# EAGLE design esp32_shield (EAGLE 7.2.0)
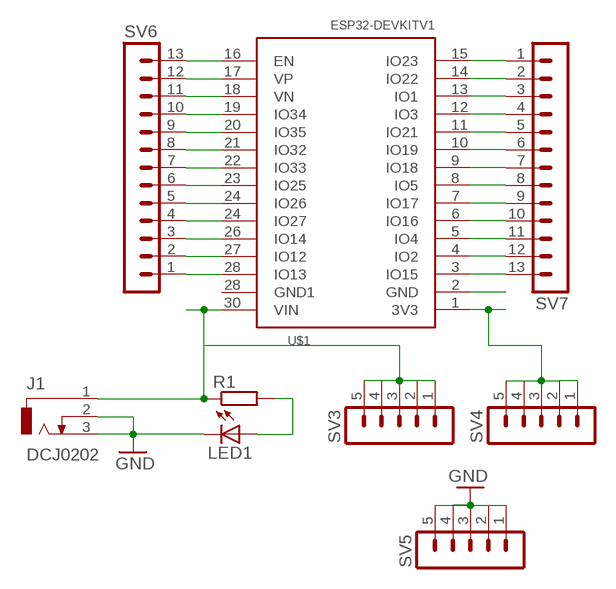
[diagram p0: schematic, sheet 1]

## Parts
J1  DCJ0202  [DCJ0202]
LED1  LED5MM  [LED5MM]
R1  R-EU_0204/7  [0204/7]
SV3  MA05-1  [MA05-1]
SV4  MA05-1  [MA05-1]
SV5  MA05-1  [MA05-1]
SV6  MA13-1  [MA13-1]
SV7  MA13-1  [MA13-1]
U$1  ESP32DEVKITV1  [ESP32-DEVKITV1]

## Nets
GND: J1.2 J1.3 LED1.K(C) SV5.1 SV5.2 SV5.3 SV5.4 SV5.5
N$1: SV7.1 U$1.15(IO23)
N$2: SV7.2 U$1.14(IO22)
N$3: SV7.3 U$1.13(IO1)
N$4: SV7.4 U$1.12(IO3)
N$5: SV7.5 U$1.11(IO21)
N$6: SV7.6 U$1.10(IO19)
N$7: SV7.7 U$1.9(IO18)
N$8: SV7.8 U$1.8(IO5)
N$9: SV7.9 U$1.7(IO17)
N$10: SV7.10 U$1.6(IO16)
N$11: SV7.11 U$1.5(IO4)
N$12: SV7.12 U$1.4(IO2)
N$13: SV7.13 U$1.3(IO15)
N$14: U$1.2(GND)
N$15: SV4.1 SV4.2 SV4.3 SV4.4 SV4.5 U$1.1(3V3)
N$16: J1.1 R1.1 SV3.1 SV3.2 SV3.3 SV3.4 SV3.5 U$1.30(VIN)
N$19: SV6.2 U$1.27(IO12)
N$20: SV6.3 U$1.26(IO14)
N$23: SV6.6 U$1.23(IO25)
N$24: SV6.7 U$1.22(IO33)
N$25: SV6.8 U$1.21(IO32)
N$26: SV6.9 U$1.20(IO35)
N$27: SV6.10 U$1.19(IO34)
N$28: SV6.11 U$1.18(VN)
N$29: SV6.12 U$1.17(VP)
N$30: SV6.13 U$1.16(EN)
N$31: SV6.1 U$1.28(IO13)
N$32: LED1.A R1.2
N$33: SV6.4 U$1.24(IO27)
N$34: SV6.5 U$1.24(IO26)
Unconnected: U$1.28(GND1)

## Library data of the parts
J1 = con-jack:DCJ0202: DC POWER JACK Source: DCJ0202.pdf; OC_FARNELL: unknown; OC_NEWARK: unknown
LED1 = led:LED: LED OSRAM: - CHIPLED LG R971, LG N971, LY N971, LG Q971, LY Q971, LO R971, LY R971 LH N974, LH R974 LS Q976, LO Q976, LY Q976 LO Q996 - Hyper CHIPLED LW Q18S LB Q993, LB Q99A, LB R99A - SideLED LS A670, LO A670, LY A670, LG A670, LP A670 LB A673, LV A673, LT A673, LW A673 LH A674 LY A675 LS A676, LA A676, LO A676, LY A676, LW A676 LS A679, LY A679, LG A679 - Hyper Micro SIDELED® LS Y876, LA Y876, LO Y876, LY Y876 LT Y87S - SmartLED LW L88C, LW L88S LB L89C, LB L89S, LG L890 LS L89K, LO L89K, LY L89K LS L896, LA L896, LO L896, LY L896 - TOPLED LS T670, LO T670, LY T670, LG T670, LP T670 LSG T670, LSP T670, LSY T670, LOP T670, LYG T670 LG T671, LOG T671, LSG T671 LB T673, LV T673, LT T673, LW T673 LH T674 LS T676, LA T676, LO T676, LY T676, LB T676, LH T676, LSB T676, LW T676 LB T67C, LV T67C, LT T67C, LS T67K, LO T67K, LY T67K, LW E67C LS E67B, LA E67B, LO E67B, LY E67B, LB E67C, LV E67C, LT E67C LW T67C LS T679, LY T679, LG T679 LS T770, LO T770, LY T770, LG T770, LP T770 LB T773, LV T773, LT T773, LW T773 LH T774 LS E675, LA E675, LY E675, LS T675 LS T776, LA T776, LO T776, LY T776, LB T776 LHGB T686 LT T68C, LB T68C - Hyper Mini TOPLED® LB M676 - Mini TOPLED Santana® LG M470 LS M47K, LO M47K, LY M47K Source: http://www.osram.convergy.de LUXEON: - LUMILED® LXK2-PW12-R00, LXK2-PW12-S00, LXK2-PW14-U00, LXK2-PW14-V00 LXK2-PM12-R00, LXK2-PM12-S00, LXK2-PM14-U00 LXK2-PE12-Q00, LXK2-PE12-R00, LXK2-PE12-S00, LXK2-PE14-T00, LXK2-PE14-U00 LXK2-PB12-K00, LXK2-PB12-L00, LXK2-PB12-M00, LXK2-PB14-N00, LXK2-PB14-P00, LXK2-PB14-Q00 LXK2-PR12-L00, LXK2-PR12-M00, LXK2-PR14-Q00, LXK2-PR14-R00 LXK2-PD12-Q00, LXK2-PD12-R00, LXK2-PD12-S00 LXK2-PH12-R00, LXK2-PH12-S00 LXK2-PL12-P00, LXK2-PL12-Q00, LXK2-PL12-R00 Source: www.luxeon.com KINGBRIGHT: KA-3528ASYC Source: www.kingbright.com
R1 = resistor:R-EU_: RESISTOR, European symbol
SV3-SV5 = con-lstb:MA05-1: PIN HEADER; OC_FARNELL: unknown; OC_NEWARK: unknown
SV6 SV7 = con-lstb:MA13-1: PIN HEADER; OC_FARNELL: unknown; OC_NEWARK: unknown
U$1 = ESP32-DEVKITV1:ESP32DEVKITV1

## Board
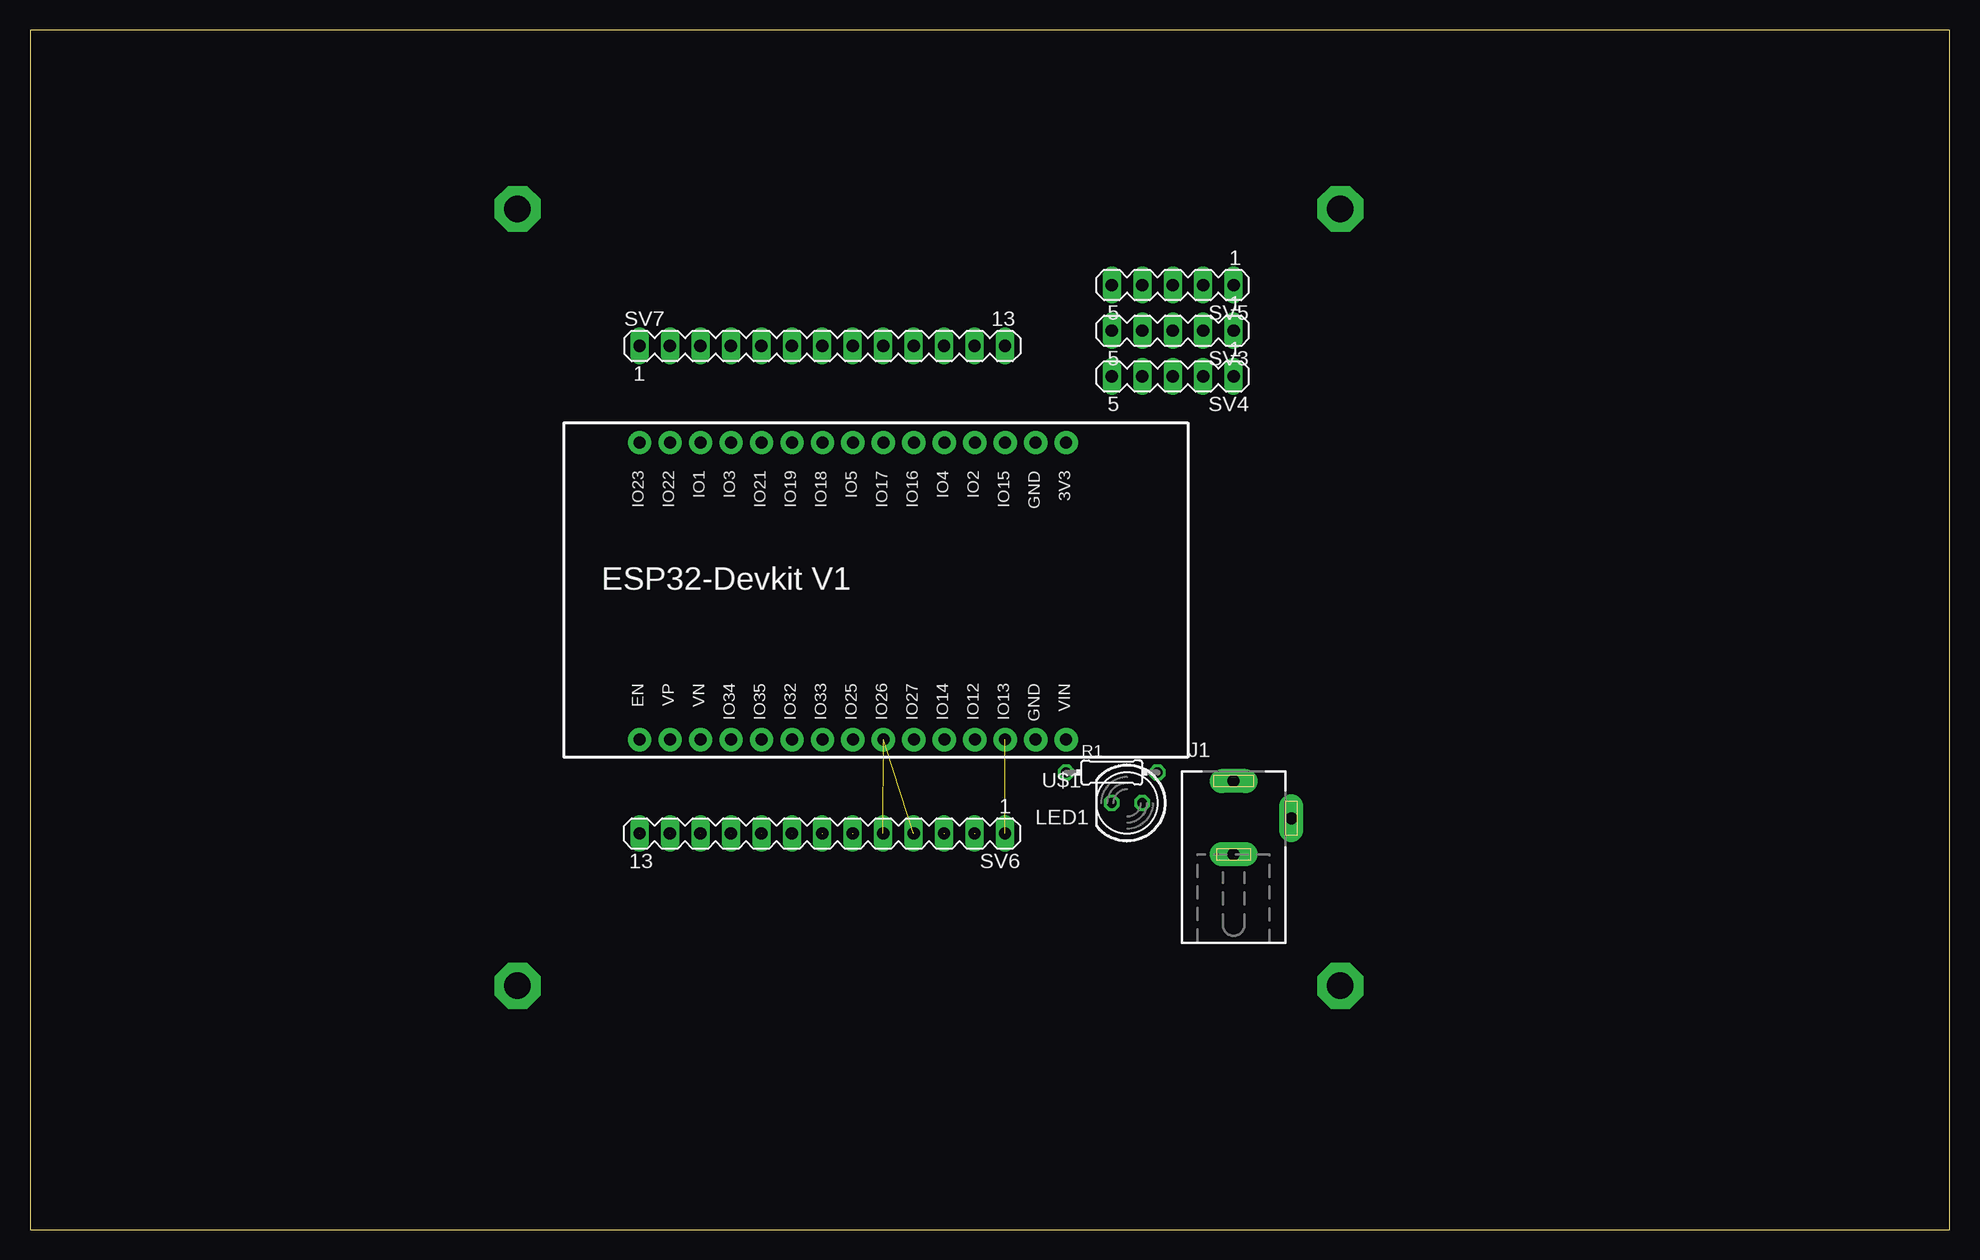
[diagram p1: board, top side]
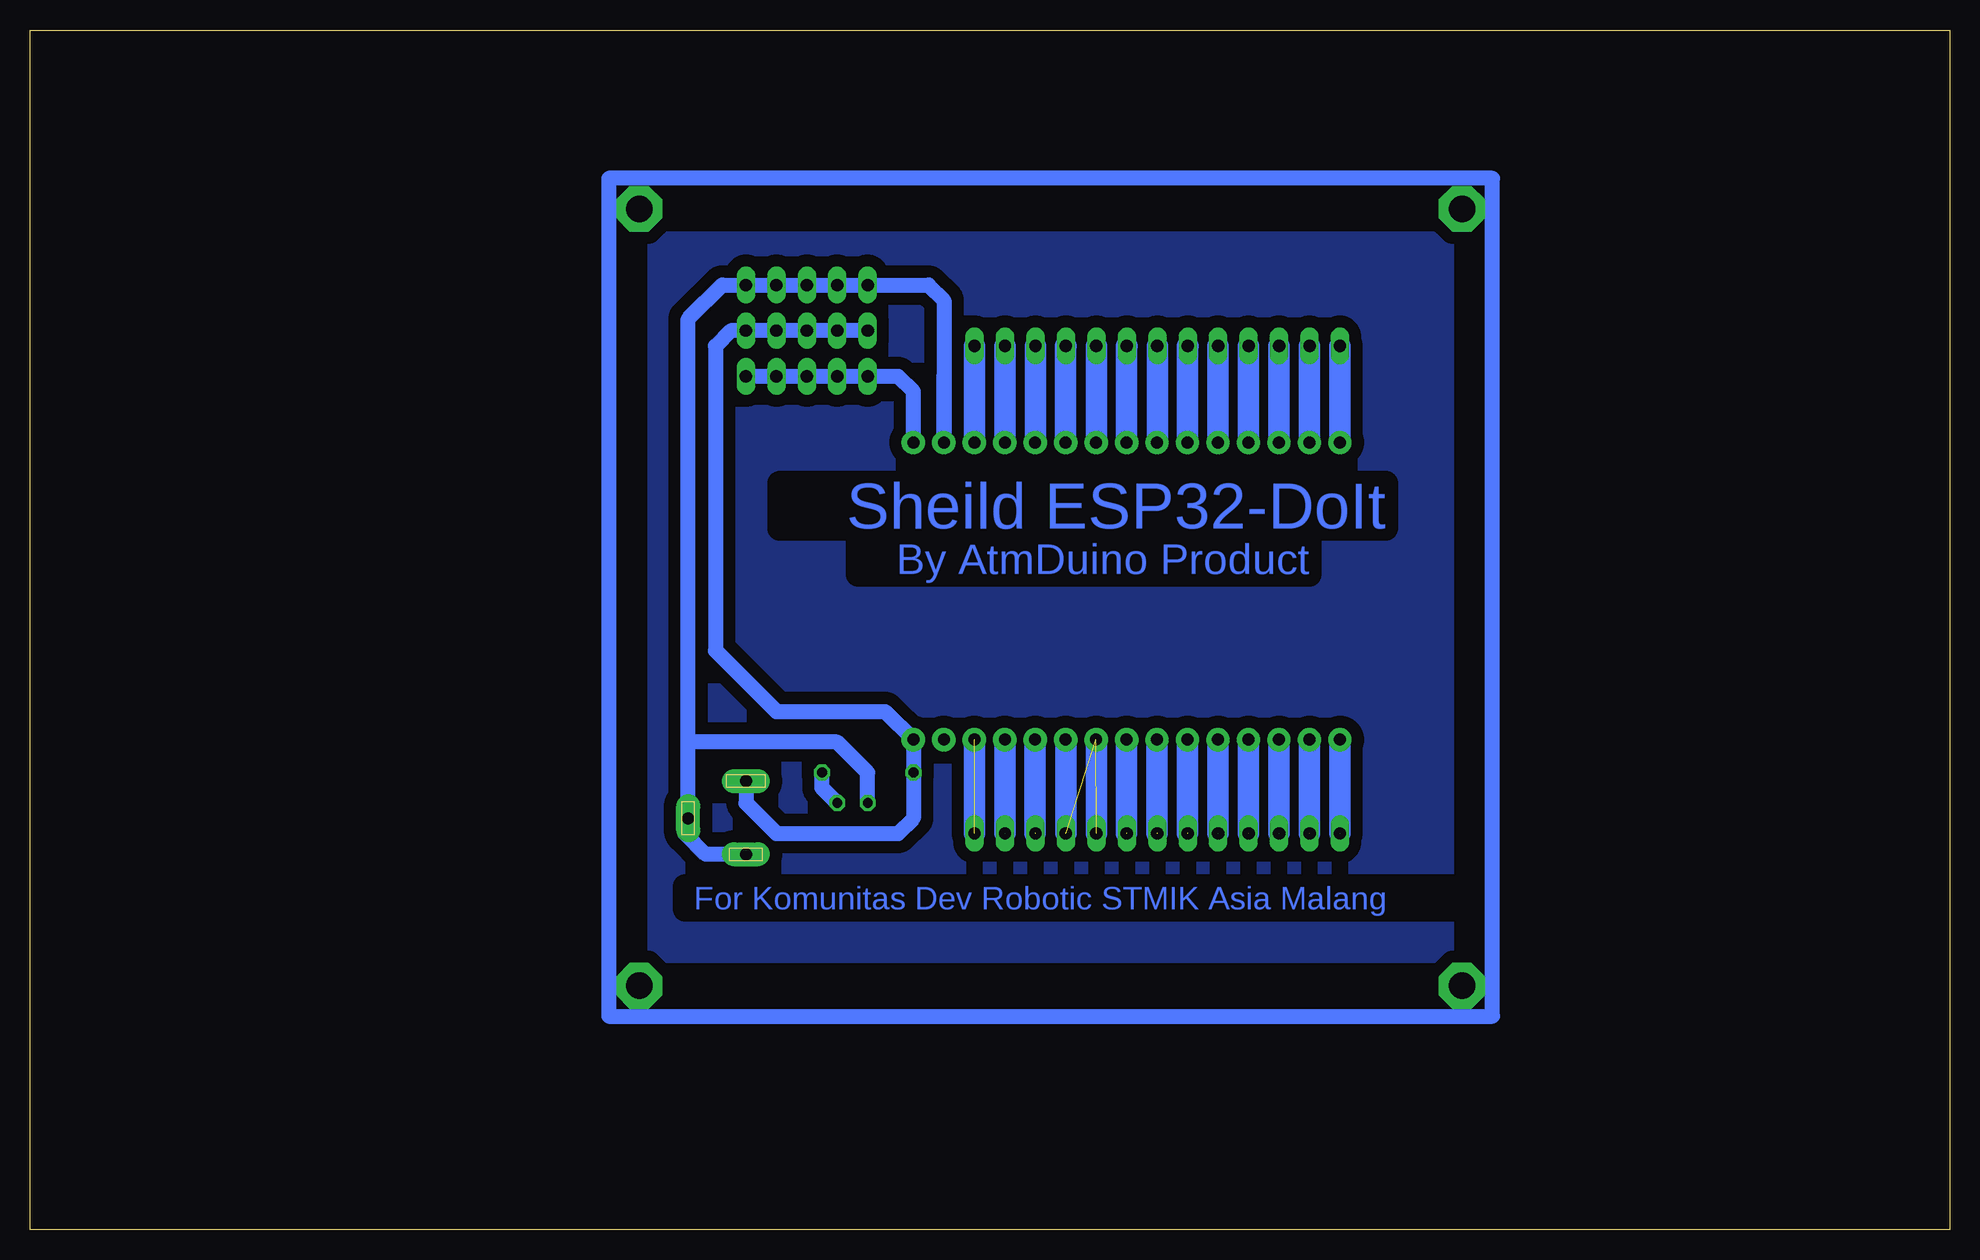
[diagram p2: board, bottom side, seen from below]

Size 160 x 100 mm. Coordinates in mm from the lower left corner, seen from the top.
Outline: 0,0 160,0 160,100 0,100 0,0
Copper layers (1*16): Top 0.035mm / dielectric 1.5mm / Bottom 0.035mm
Design rules "default": minimum track width 10mil, minimum drill 24mil, track to track 8mil, track to pad 8mil, pad to pad 8mil, via to via 8mil, smd to smd 8mil, copper to edge 40mil, drill to drill 8mil, minimum pad ring 10mil, minimum via ring 8mil, stop-mask expansion 4mil, vias tented up to drill 0mil, thermal gap 10mil

### Footprints (pad centres in the part's own frame; a part is rotated, then mirrored left to right if it is on the bottom)
DCJ0202 = drill 1 pad 2 long: 1 0,3.1; 2 4.8,0; 3 0,-3
LED5MM = drill 0.813 octagon: A -1.27,0; K 1.27,0
0204/7 = drill 0.813 octagon: 1 -3.81,0; 2 3.81,0
MA05-1 = drill 1.016 long: 1 -5.08,0; 2 -2.54,0; 3 0,0; 4 2.54,0; 5 5.08,0
MA13-1 = drill 1.016 long: 1 -15.24,0; 2 -12.7,0; 3 -10.16,0; 4 -7.62,0; 5 -5.08,0; 6 -2.54,0; 7 0,0; 8 2.54,0; 9 5.08,0; 10 7.62,0; 11 10.16,0; 12 12.7,0; 13 15.24,0
ESP32-DEVKITV1 = drill 1 pad 1.93: 1 -22.87,-13.54; 2 -20.33,-13.54; 3 -17.79,-13.54; 4 -15.25,-13.54; 5 -12.71,-13.54; 6 -10.17,-13.54; 7 -7.63,-13.54; 8 -5.09,-13.54; 9 -2.55,-13.54; 10 -0.01,-13.54; 11 2.53,-13.54; 12 5.07,-13.54; 13 7.61,-13.54; 14 10.15,-13.54; 15 12.69,-13.54; 16 12.69,11.23; 17 10.15,11.23; 18 7.61,11.23; 19 5.07,11.23; 20 2.53,11.23; 21 -0.01,11.23; 22 -2.55,11.23; 23 -5.09,11.23; 24 -7.63,11.23; 25 -10.17,11.23; 26 -12.71,11.23; 27 -15.25,11.23; 28 -17.79,11.23; 29 -20.33,11.23; 30 -22.87,11.23

### Placement (x,y rotation side)
J1  100.33,34.29 0 top
LED1  91.44,35.56 180 top
R1  90.17,38.1 0 top
SV3  95.25,74.93 180 top
SV4  95.25,71.12 180 top
SV5  95.25,78.74 180 top
SV6  66.04,33.02 180 top
SV7  66.04,73.66 0 top
U$1  63.5,52.07 180 top

### Tracks (layer width: path | path; a pad name or v marks a point on that pad's centre or on a via)
GND
  Bottom 1.27: LED1.K 90.17,38.1 92.71,40.64 105.13,40.64 | J1.3 103.68,31.29 105.41,33.02 105.41,34.01 J1.2 105.13,40.64 | 105.13,40.64 105.13,75.92 102.31,78.74 SV5.1 SV5.2 SV5.3 SV5.4 SV5.5 85.09,78.74 83.82,77.47 83.82,66.04
N$1
  Bottom 1.778: U$1.15 SV7.1
N$2
  Bottom 1.778: U$1.14 SV7.2
N$3
  Bottom 1.778: U$1.13 SV7.3
N$4
  Bottom 1.778: SV7.4 U$1.12
N$5
  Bottom 1.778: SV7.5 U$1.11
N$6
  Bottom 1.778: U$1.10 SV7.6
N$7
  Bottom 1.778: SV7.7 U$1.9
N$8
  Bottom 1.778: U$1.8 SV7.8
N$9
  Bottom 1.778: SV7.9 U$1.7
N$10
  Bottom 1.778: U$1.6 SV7.10
N$11
  Bottom 1.778: SV7.11 U$1.5
N$12
  Bottom 1.778: U$1.4 SV7.12
N$13
  Bottom 1.778: SV7.13 U$1.3
N$14
  Bottom 1.27: U$1.2 83.83,71.11
N$15
  Bottom 1.27: SV4.1 SV4.2 SV4.3 SV4.4 SV4.5 87.63,71.12 86.37,69.86 U$1.1
N$16
  Bottom 1.27: SV3.1 SV3.2 SV3.3 SV3.4 SV3.5 101.6,74.93 102.87,73.66 102.87,48.26 97.79,43.18 88.71,43.18 U$1.30 R1.1 86.36,34.29 87.63,33.02 97.79,33.02 100.33,35.56 J1.1
N$17
  Bottom 1.778: 81.28,33.02 81.28,40.64
N$19  (1 unrouted)
  Bottom 1.778: U$1.27 SV6.2
N$20  (1 unrouted)
  Bottom 1.778: U$1.26 SV6.3
N$21
  Bottom 1.778: 71.12,33.02 71.12,40.64
N$22
  Bottom 1.778: 73.66,33.02 73.66,40.64
N$23  (1 unrouted)
  Bottom 1.778: U$1.23 SV6.6
N$24  (1 unrouted)
  Bottom 1.778: U$1.22 SV6.7
N$25  (1 unrouted)
  Bottom 1.778: U$1.21 SV6.8
N$26  (1 unrouted)
  Bottom 1.778: U$1.20 SV6.9
N$27  (1 unrouted)
  Bottom 1.778: U$1.19 SV6.10
N$28  (1 unrouted)
  Bottom 1.778: U$1.18 SV6.11
N$29  (1 unrouted)
  Bottom 1.778: U$1.17 SV6.12
N$30  (1 unrouted)
  Bottom 1.778: U$1.16 SV6.13
N$31  (1 unrouted)
N$32
  Bottom 1.27: LED1.A 93.98,36.83 R1.2
N$33  (1 unrouted)
N$34  (1 unrouted)
N$35
  pour Bottom (isolate 1.016): 41.91,22.86 41.91,82.55 107.95,82.55 107.95,22.86
N$36
  Bottom 1.27: 38.1,17.78 38.1,87.63 111.76,87.63 111.76,17.78 38.1,17.78
N$37  (via drill 2.2 pad 3.81)
  other vias: 40.64,20.32
N$38  (via drill 2.2 pad 3.81)
  other vias: 40.64,85.09
N$39  (via drill 2.2 pad 3.81)
  other vias: 109.22,85.09
N$40  (via drill 2.2 pad 3.81)
  other vias: 109.22,20.32

### Text on the board
Bottom: Sheild ESP32-DoIt | By AtmDuino Product | For Komunitas Dev Robotic STMIK Asia Malang